# EAGLE design platine éclairage voiture (EAGLE 6.5.0)
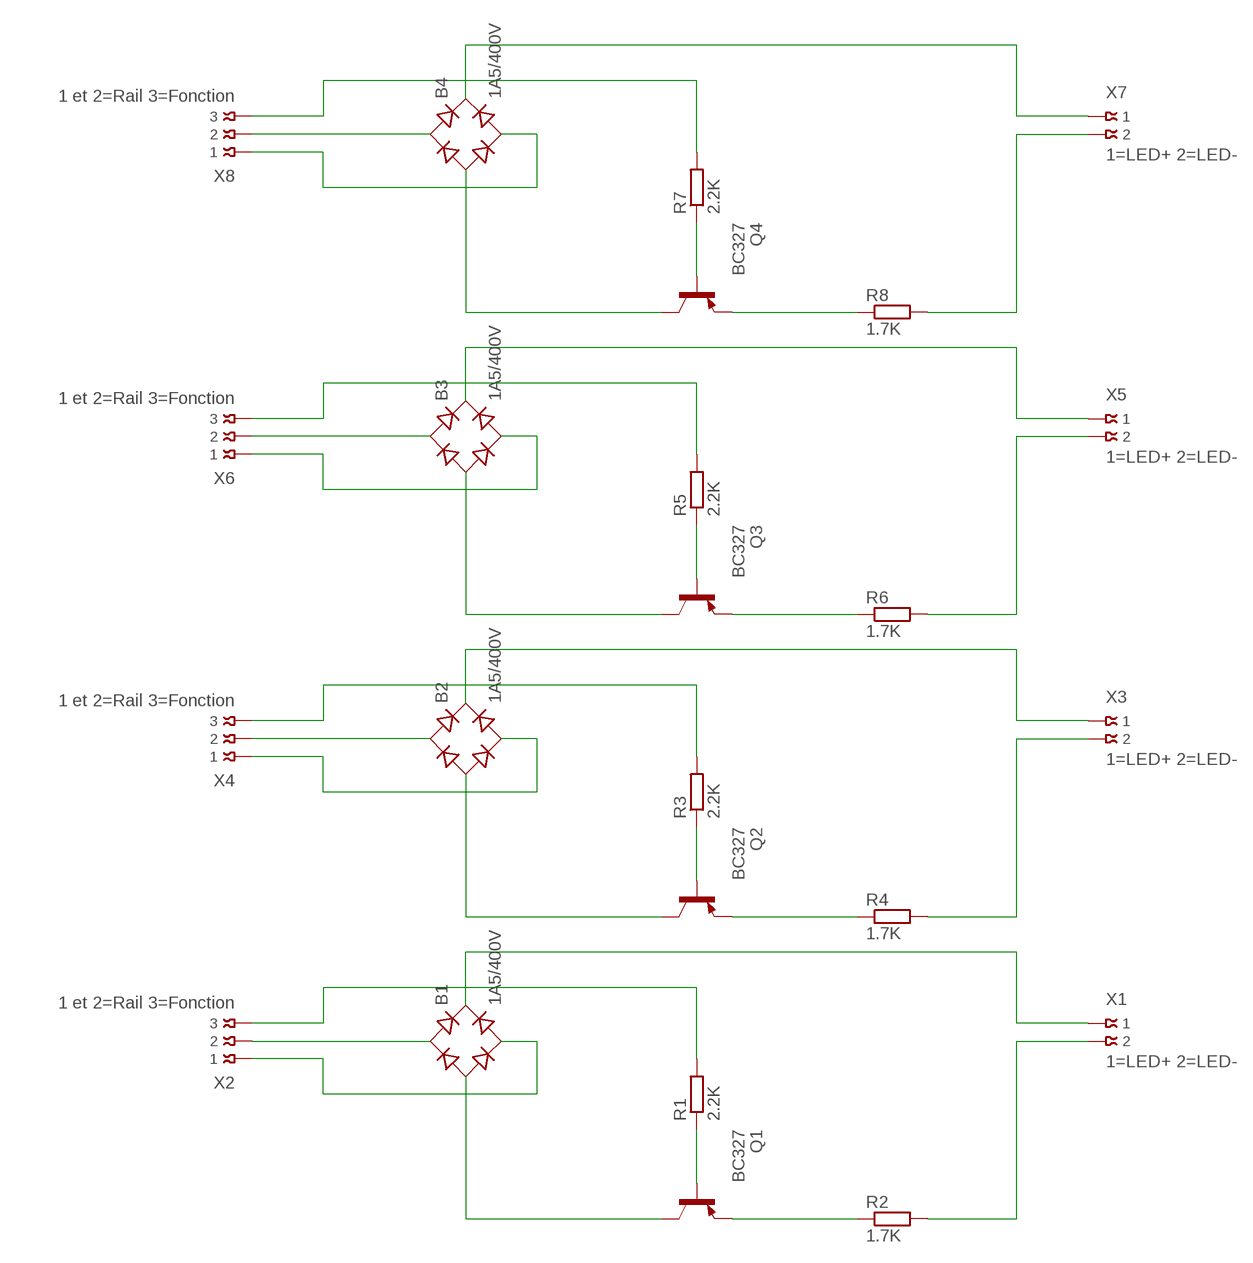
[diagram p0: schematic, sheet 1]

## Parts
B1  1A5/400V  RECTIFIER-RB1A  [RB1A]
B2  1A5/400V  RECTIFIER-RB1A  [RB1A]
B3  1A5/400V  RECTIFIER-RB1A  [RB1A]
B4  1A5/400V  RECTIFIER-RB1A  [RB1A]
Q1  BC327  [TO92-EBC]
Q2  BC327  [TO92-EBC]
Q3  BC327  [TO92-EBC]
Q4  BC327  [TO92-EBC]
R1  2.2K  R-EU_0207/10  [0207/10]
R2  1.7K  R-EU_0207/10  [0207/10]
R3  2.2K  R-EU_0207/10  [0207/10]
R4  1.7K  R-EU_0207/10  [0207/10]
R5  2.2K  R-EU_0207/10  [0207/10]
R6  1.7K  R-EU_0207/10  [0207/10]
R7  2.2K  R-EU_0207/10  [0207/10]
R8  1.7K  R-EU_0207/10  [0207/10]
X1  1=LED+ 2=LED-  009176002  [009176002]
X2  1 et 2=Rail 3=Fonction  009176003  [009176003]
X3  1=LED+ 2=LED-  009176002  [009176002]
X4  1 et 2=Rail 3=Fonction  009176003  [009176003]
X5  1=LED+ 2=LED-  009176002  [009176002]
X6  1 et 2=Rail 3=Fonction  009176003  [009176003]
X7  1=LED+ 2=LED-  009176002  [009176002]
X8  1 et 2=Rail 3=Fonction  009176003  [009176003]

## Nets
N$1: B1.- Q1.C
N$2: Q1.B R1.1
N$3: R1.2 X2.3
N$4: Q1.E R2.1
N$5: R2.2 X1.2
N$6: B1.+ X1.1
N$7: B1.AC1 X2.2
N$8: B1.AC2 X2.1
N$9: B2.- Q2.C
N$10: Q2.B R3.1
N$11: R3.2 X4.3
N$12: Q2.E R4.1
N$13: R4.2 X3.2
N$14: B2.+ X3.1
N$15: B2.AC1 X4.2
N$16: B2.AC2 X4.1
N$17: B3.- Q3.C
N$18: Q3.B R5.1
N$19: R5.2 X6.3
N$20: Q3.E R6.1
N$21: R6.2 X5.2
N$22: B3.+ X5.1
N$23: B3.AC2 X6.1
N$24: B3.AC1 X6.2
N$25: B4.- Q4.C
N$26: Q4.B R7.1
N$27: R7.2 X8.3
N$28: Q4.E R8.1
N$29: R8.2 X7.2
N$30: B4.+ X7.1
N$31: B4.AC2 X8.1
N$32: B4.AC1 X8.2

## Library data of the parts
B1-B4 = rectifier:RECTIFIER-: Rectifier
Q1-Q4 = transistor-pnp:BC327*: PNP Transistror
R1-R8 = resistor:R-EU_: RESISTOR, European symbol
X1 X3 X5 X7 = con-avx:00917?002: Wire to Board Strip IDC Connector 2 WAY Source: http://www.avx.com/docs/Catalogs/9176.pdf http://www.avx.com/docs/Catalogs/9177.pdf; MPN: 009176002001006; OC_FARNELL: 1582834; OC_NEWARK: 66M1960
X2 X4 X6 X8 = con-avx:00917?003: Wire to Board Strip IDC Connector 3 WAY Source: http://www.avx.com/docs/Catalogs/9176.pdf http://www.avx.com/docs/Catalogs/9177.pdf; MPN: 009176003001106; OC_FARNELL: 1778540; OC_NEWARK: 52R7005

## Board
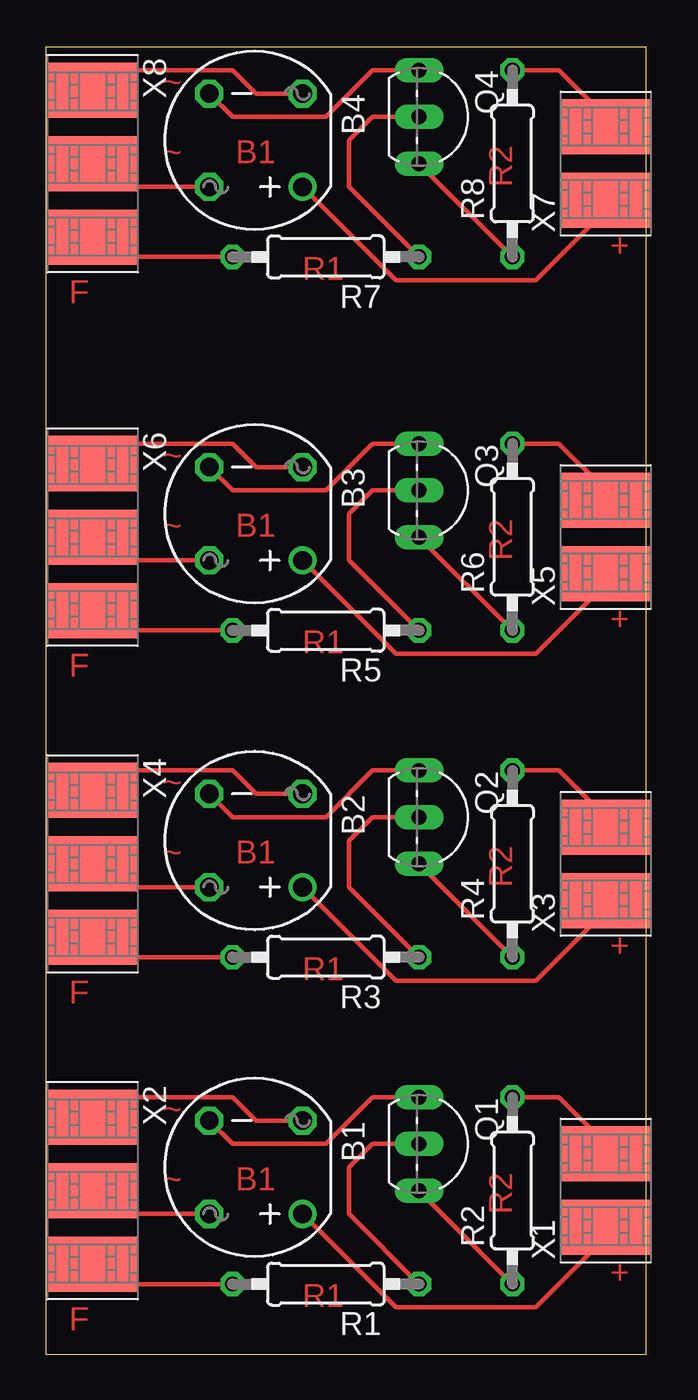
[diagram p1: board, top side]

Size 32.69 x 71.11 mm. Coordinates in mm from the lower left corner, seen from the top.
Outline: 0,0 32.69,0 32.69,71.11 0,71.11 0,0
Copper layers (1*16): Top 0.035mm / dielectric 1.5mm / Bottom 0.035mm
Design rules "default": minimum track width 10mil, minimum drill 24mil, track to track 8mil, track to pad 8mil, pad to pad 8mil, via to via 8mil, smd to smd 8mil, copper to edge 40mil, drill to drill 8mil, minimum pad ring 10mil, minimum via ring 8mil, stop-mask expansion 4mil, vias tented up to drill 0mil, thermal gap 10mil

### Footprints (pad centres in the part's own frame; a part is rotated, then mirrored left to right if it is on the bottom)
RB1A = drill 1.016: + -2.54,2.54 | drill 1.016 octagon: - 2.54,-2.54; AC1 2.54,2.54; AC2 -2.54,-2.54
TO92-EBC = drill 0.813 long: B 0,-1.27; C -2.54,-1.27; E 2.54,-1.27
0207/10 = drill 0.813 octagon: 1 -5.08,0; 2 5.08,0
009176002 = smd 3 x 5: 1 -2,0; 2 2,0
009176003 = smd 3 x 5: 1 -4,0; 2 0,0; 3 4,0

### Placement (x,y rotation side)
B1  11.43,10.16 180 top
B2  11.43,27.94 180 top
B3  11.43,45.72 180 top
B4  11.43,66.04 180 top
Q1  21.59,11.43 270 top
Q2  21.59,29.21 270 top
Q3  21.59,46.99 270 top
Q4  21.59,67.31 270 top
R1  15.24,3.81 180 top
R2  25.4,8.89 90 top
R3  15.24,21.59 180 top
R4  25.4,26.67 90 top
R5  15.24,39.37 180 top
R6  25.4,44.45 90 top
R7  15.24,59.69 180 top
R8  25.4,64.77 90 top
X1  30.48,8.89 90 top
X2  2.54,8.89 270 top
X3  30.48,26.67 90 top
X4  2.54,26.67 270 top
X5  30.48,44.45 90 top
X6  2.54,44.45 270 top
X7  30.48,64.77 90 top
X8  2.54,64.77 270 top

### Tracks (layer width: path | path; a pad name or v marks a point on that pad's centre or on a via)
N$1
  Top 0.254: Q1.C 17.78,13.97 15.24,11.43 10.16,11.43 B1.-
N$2
  Top 0.254: R1.1 16.51,7.62 16.51,10.16 17.78,11.43 Q1.B
N$3
  Top 0.254: R1.2 2.54,3.81 X2.3
N$4
  Top 0.254: Q1.E R2.1
N$5
  Top 0.254: R2.2 27.94,13.97 30.48,11.43 X1.2
N$6
  Top 0.254: B1.+ 19.05,2.54 26.67,2.54 30.48,6.35 X1.1
N$7
  Top 0.254: B1.AC1 3.81,7.62 X2.2
N$8
  Top 0.254: B1.AC2 11.43,12.7 10.16,13.97 2.54,13.97 X2.1
N$9
  Top 0.254: Q2.C 17.78,31.75 15.24,29.21 10.16,29.21 B2.-
N$10
  Top 0.254: R3.1 16.51,25.4 16.51,27.94 17.78,29.21 Q2.B
N$11
  Top 0.254: R3.2 2.54,21.59 X4.3
N$12
  Top 0.254: Q2.E R4.1
N$13
  Top 0.254: R4.2 27.94,31.75 30.48,29.21 X3.2
N$14
  Top 0.254: B2.+ 19.05,20.32 26.67,20.32 30.48,24.13 X3.1
N$15
  Top 0.254: B2.AC1 3.81,25.4 X4.2
N$16
  Top 0.254: B2.AC2 11.43,30.48 10.16,31.75 2.54,31.75 X4.1
N$17
  Top 0.254: Q3.C 17.78,49.53 15.24,46.99 10.16,46.99 B3.-
N$18
  Top 0.254: R5.1 16.51,43.18 16.51,45.72 17.78,46.99 Q3.B
N$19
  Top 0.254: R5.2 2.54,39.37 X6.3
N$20
  Top 0.254: Q3.E R6.1
N$21
  Top 0.254: R6.2 27.94,49.53 30.48,46.99 X5.2
N$22
  Top 0.254: B3.+ 19.05,38.1 26.67,38.1 30.48,41.91 X5.1
N$23
  Top 0.254: B3.AC2 11.43,48.26 10.16,49.53 2.54,49.53 X6.1
N$24
  Top 0.254: B3.AC1 3.81,43.18 X6.2
N$25
  Top 0.254: Q4.C 17.78,69.85 15.24,67.31 10.16,67.31 B4.-
N$26
  Top 0.254: R7.1 16.51,63.5 16.51,66.04 17.78,67.31 Q4.B
N$27
  Top 0.254: R7.2 2.54,59.69 X8.3
N$28
  Top 0.254: Q4.E R8.1
N$29
  Top 0.254: X7.2 30.48,67.31 27.94,69.85 R8.2
N$30
  Top 0.254: 30.48,63.5 X7.1 30.48,62.23 26.67,58.42 19.05,58.42 B4.+
N$31
  Top 0.254: B4.AC2 11.43,68.58 10.16,69.85 2.54,69.85 X8.1
N$32
  Top 0.254: B4.AC1 3.81,63.5 X8.2

### Text on the board
Top: ~ | B1 | ~ | R2 | + | F | R1 | ~ | B1 | ~ | R2 | + | F | R1 | ~ | B1 | ~ | R2 | + | F | R1 | ~ | B1 | ~ | R2 | + | F | R1